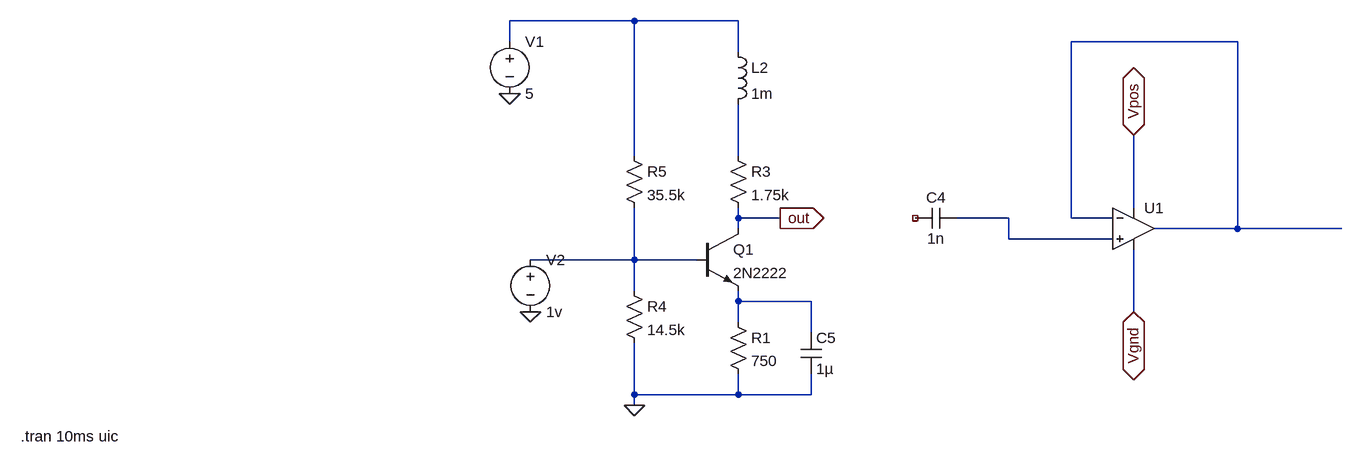
[diagram p0: schematic oscillator_amp_test.asc]
oscillator_amp_test.asc, the LTspice schematic file:
Version 4.1
SHEET 1 2244 680
WIRE 1056 -256 864 -256
WIRE 1216 -256 1056 -256
WIRE 864 -224 864 -256
WIRE 1984 -224 1728 -224
WIRE 1216 -208 1216 -256
WIRE 1056 -48 1056 -256
WIRE 1216 -48 1216 -128
WIRE 1824 32 1824 -80
WIRE 1216 48 1216 32
WIRE 1280 48 1216 48
WIRE 1632 48 1552 48
WIRE 1728 48 1728 -224
WIRE 1792 48 1728 48
WIRE 1216 64 1216 48
WIRE 1984 64 1984 -224
WIRE 1984 64 1856 64
WIRE 2144 64 1984 64
WIRE 1632 80 1632 48
WIRE 1792 80 1632 80
WIRE 1056 112 1056 32
WIRE 1056 112 896 112
WIRE 1152 112 1056 112
WIRE 1056 160 1056 112
WIRE 1216 176 1216 160
WIRE 1328 176 1216 176
WIRE 1824 192 1824 96
WIRE 1216 208 1216 176
WIRE 1328 224 1328 176
WIRE 1056 320 1056 240
WIRE 1216 320 1216 288
WIRE 1216 320 1056 320
WIRE 1328 320 1328 288
WIRE 1328 320 1216 320
WIRE 1056 336 1056 320
FLAG 1280 48 out
IOPIN 1280 48 Out
FLAG 1824 -80 Vpos
IOPIN 1824 -80 BiDir
FLAG 1824 192 Vgnd
IOPIN 1824 192 BiDir
FLAG 864 -144 0
FLAG 1056 336 0
FLAG 896 192 0
SYMBOL npn 1152 64 R0
SYMATTR InstName Q1
SYMATTR Value 2N2222
SYMBOL res 1200 192 R0
SYMATTR InstName R1
SYMATTR Value 750
SYMBOL res 1200 -64 R0
SYMATTR InstName R3
SYMATTR Value 1.75k
SYMBOL res 1040 144 R0
SYMATTR InstName R4
SYMATTR Value 14.5k
SYMBOL res 1040 -64 R0
SYMATTR InstName R5
SYMATTR Value 35.5k
SYMBOL ind 1200 -224 R0
SYMATTR InstName L2
SYMATTR Value 1m
SYMBOL cap 1552 32 R90
WINDOW 0 0 32 VBottom 2
WINDOW 3 32 32 VTop 2
SYMATTR InstName C4
SYMATTR Value 1n
SYMBOL cap 1312 224 R0
SYMATTR InstName C5
SYMATTR Value 1µ
SYMBOL OpAmps\\UniversalOpAmp2 1824 64 R0
SYMATTR InstName U1
SYMBOL voltage 864 -240 R0
WINDOW 123 0 0 Left 0
WINDOW 39 0 0 Left 0
SYMATTR InstName V1
SYMATTR Value 5
SYMBOL voltage 896 96 R0
WINDOW 123 0 0 Left 0
WINDOW 39 0 0 Left 0
SYMATTR InstName V2
SYMATTR Value 1v
TEXT 112 384 Left 2 !.tran 10ms uic

The netlist it stands for:
* oscillator_amp_test.asc
Q1 out N005 N006 0 2N2222
R1 N006 0 750
R3 N003 out 1.75k
R4 N005 0 14.5k
R5 N001 N005 35.5k
L2 N001 N003 1m
C4 N004 NC_01 1n
C5 N006 0 1µ
X§U1 N004 N002 Vpos Vgnd N002 level2 Avol=1Meg GBW=10Meg Slew=10Meg Ilimit=25m Rail=0 Vos=0 En=0 Enk=0 In=0 Ink=0 Rin=500Meg  ; pins In+ In- V+ V- OUT
V1 N001 0 5
V2 N005 0 1v
.model NPN NPN
.model PNP PNP
.lib standard.bjt
.tran 10ms uic
.lib UniversalOpAmp2.lib
.backanno
.end